# EAGLE design InternetButtonBuzzer (EAGLE 7.2.0)
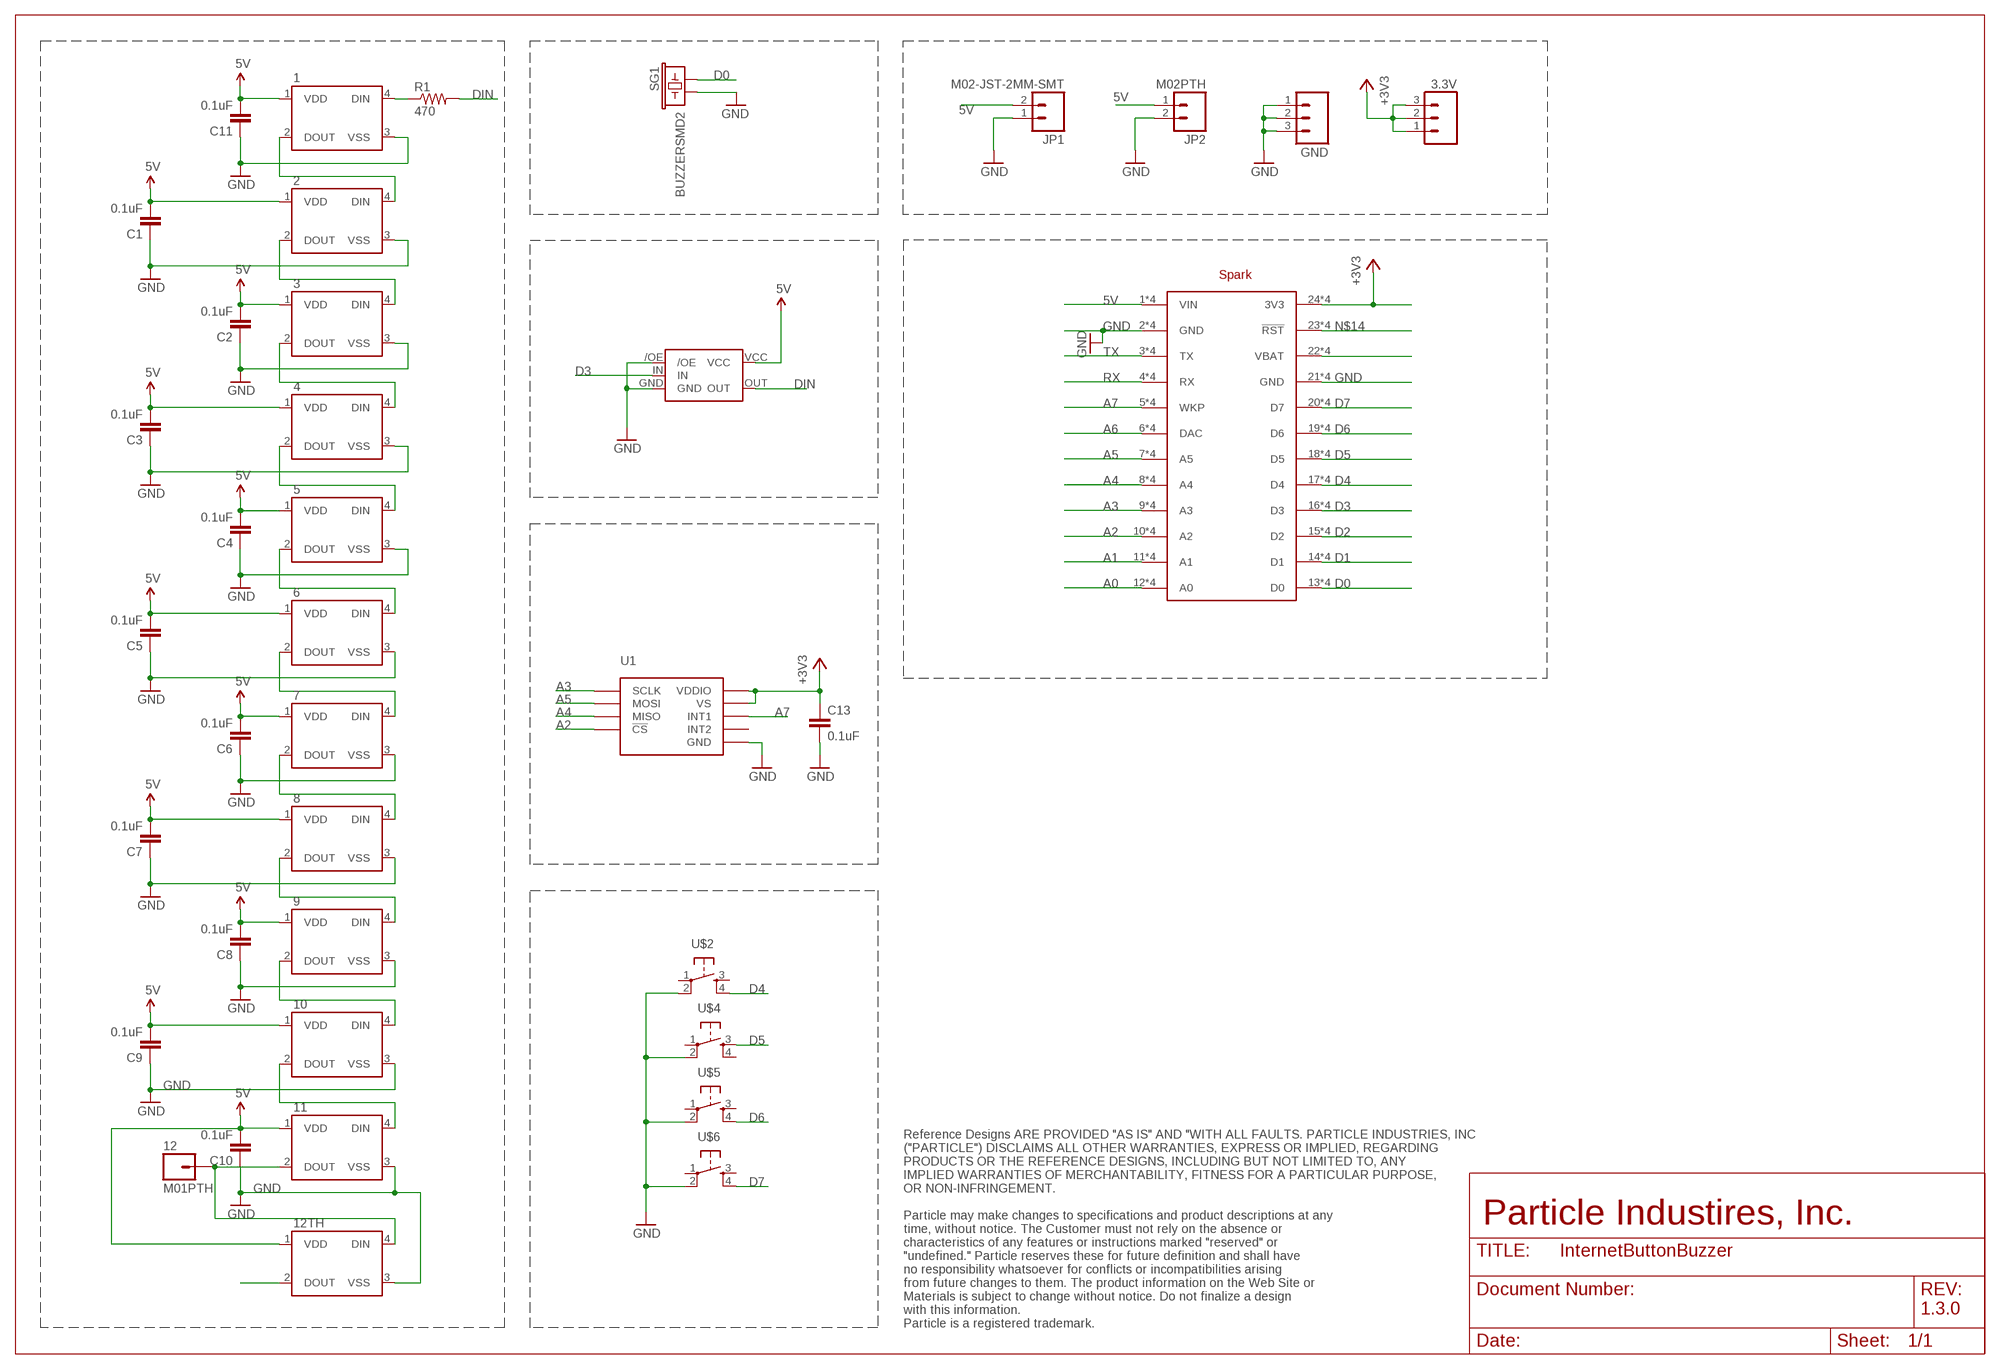
[diagram p0: schematic, sheet 1]

## Parts
1  WS2812B  [WS2812B]
2  WS2812B  [WS2812B]
3  WS2812B  [WS2812B]
3.3V  M03LOCK_NO_SILK  [1X03_LOCK_NO_SILK]
4  WS2812B  [WS2812B]
5  WS2812B  [WS2812B]
6  WS2812B  [WS2812B]
7  WS2812B  [WS2812B]
8  WS2812B  [WS2812B]
9  WS2812B  [WS2812B]
10  WS2812B  [WS2812B]
11  WS2812B  [WS2812B]
12  M01PTH  [1X01]
12TH  WS2812B  [NOCREAM_WS2812B]
C1  0.1uF  15PF-50V-5%(0603)  [0603-CAP]
C2  0.1uF  15PF-50V-5%(0603)  [0603-CAP]
C3  0.1uF  15PF-50V-5%(0603)  [0603-CAP]
C4  0.1uF  15PF-50V-5%(0603)  [0603-CAP]
C5  0.1uF  15PF-50V-5%(0603)  [0603-CAP]
C6  0.1uF  15PF-50V-5%(0603)  [0603-CAP]
C7  0.1uF  15PF-50V-5%(0603)  [0603-CAP]
C8  0.1uF  15PF-50V-5%(0603)  [0603-CAP]
C9  0.1uF  15PF-50V-5%(0603)  [0603-CAP]
C10  0.1uF  15PF-50V-5%(0603)  [0603-CAP]
C11  0.1uF  15PF-50V-5%(0603)  [0603-CAP]
C13  0.1uF  CAP0603-CAP  [0603-CAP]
GND  M03LOCK_NO_SILK  [1X03_LOCK_NO_SILK]
JP1  M02-JST-2MM-SMT  [JST-2-SMD]
JP2  M02PTH  [1X02]
R1  470  470OHM1/10W1%(0603)  [0603-RES]
SG1  BUZZERSMD2  [BUZZER-CCV]
U1  ADXL362ADXL362-1:1  [ADXL362-1:1]
U$2  12MM_TACTILE_SWITCH  [12MM_TACTILE_SWITCH]
U$3  SPARK_LOGO_WITH_PLANE  [SPARK_LOGO_PLUS_PLANE]
U$4  12MM_TACTILE_SWITCH  [12MM_TACTILE_SWITCH]
U$5  12MM_TACTILE_SWITCH  [12MM_TACTILE_SWITCH]
U$6  12MM_TACTILE_SWITCH  [12MM_TACTILE_SWITCH]
U$7  SPARK_COREDUAL_HEADER  [SPARK_CORE_DUAL_HEADER]
U$8  NL17SZ125SOT553  [SOT-553]

## Nets
5V: 1.1(VDD) 2.1(VDD) 3.1(VDD) 4.1(VDD) 5.1(VDD) 6.1(VDD) 7.1(VDD) 8.1(VDD) 9.1(VDD) 10.1(VDD) 11.1(VDD) 12TH.1(VDD) C1.2 C2.2 C3.2 C4.2 C5.2 C6.2 C7.2 C8.2 C9.2 C10.2 C11.2 JP1.2 JP2.1 U$7.1(VIN) U$7.1B(VIN) U$7.@1(VIN) U$7.@1B(VIN) U$8.VCC
+3V3: 3.3V.1 3.3V.2 3.3V.3 C13.1 U1.P$1(VDDIO) U1.P$14(VS) U$7.24(3V3) U$7.24B(3V3) U$7.@24(3V3) U$7.@24B(3V3)
A0: U$7.12(A0) U$7.12B(A0) U$7.@12(A0) U$7.@12B(A0)
A1: U$7.11(A1) U$7.11B(A1) U$7.@11(A1) U$7.@11B(A1)
A2: U1.P$8(!CS) U$7.10(A2) U$7.10B(A2) U$7.@10(A2) U$7.@10B(A2)
A3: U1.P$4(SCLK) U$7.9(A3) U$7.9B(A3) U$7.@9(A3) U$7.@9B(A3)
A4: U1.P$7(MISO) U$7.8(A4) U$7.8B(A4) U$7.@8(A4) U$7.@8B(A4)
A5: U1.P$6(MOSI) U$7.7(A5) U$7.7B(A5) U$7.@7(A5) U$7.@7B(A5)
A6: U$7.6(DAC) U$7.6B(DAC) U$7.@6(DAC) U$7.@6B(DAC)
A7: U1.P$11(INT1) U$7.5(WKP) U$7.5B(WKP) U$7.@5(WKP) U$7.@5B(WKP)
D0: SG1.+ U$7.13(D0) U$7.13B(D0) U$7.@13(D0) U$7.@13B(D0)
D1: U$7.14(D1) U$7.14B(D1) U$7.@14(D1) U$7.@14B(D1)
D2: U$7.15(D2) U$7.15B(D2) U$7.@15(D2) U$7.@15B(D2)
D3: U$7.16(D3) U$7.16B(D3) U$7.@16(D3) U$7.@16B(D3) U$8.IN
D4: U$2.4 U$7.17(D4) U$7.17B(D4) U$7.@17(D4) U$7.@17B(D4)
D5: U$4.3 U$7.18(D5) U$7.18B(D5) U$7.@18(D5) U$7.@18B(D5)
D6: U$5.4 U$7.19(D6) U$7.19B(D6) U$7.@19(D6) U$7.@19B(D6)
D7: U$6.4 U$7.20(D7) U$7.20B(D7) U$7.@20(D7) U$7.@20B(D7)
DIN: R1.2 U$8.OUT
GND: 1.3(VSS) 2.3(VSS) 3.3(VSS) 4.3(VSS) 5.3(VSS) 6.3(VSS) 7.3(VSS) 8.3(VSS) 9.3(VSS) 10.3(VSS) 11.3(VSS) 12TH.3(VSS) C1.1 C2.1 C3.1 C4.1 C5.1 C6.1 C7.1 C8.1 C9.1 C10.1 C11.1 C13.2 GND.1 GND.2 GND.3 JP1.1 JP2.2 SG1.- U1.P$12(GND) U1.P$13(GND) U1.P$16(GND) U$2.2 U$4.2 U$5.2 U$6.2 U$7.2(GND) U$7.2B(GND) U$7.21(GND) U$7.21B(GND) U$7.@2(GND) U$7.@2B(GND) U$7.@21(GND) U$7.@21B(GND) U$8./OE U$8.GND
N$1: 2.2(DOUT) 3.4(DIN)
N$2: 3.2(DOUT) 4.4(DIN)
N$3: 12TH.2(DOUT)
N$5: 11.2(DOUT) 12.1 12TH.4(DIN)
N$8: 7.2(DOUT) 8.4(DIN)
N$9: 8.2(DOUT) 9.4(DIN)
N$11: 9.2(DOUT) 10.4(DIN)
N$12: 10.2(DOUT) 11.4(DIN)
N$14: U$7.23(!RST) U$7.23B(!RST) U$7.@23(!RST) U$7.@23B(!RST)
N$15: U$7.22(VBAT) U$7.22B(VBAT) U$7.@22(VBAT) U$7.@22B(VBAT)
N$16: 1.4(DIN) R1.1
N$17: 4.2(DOUT) 5.4(DIN)
N$18: 5.2(DOUT) 6.4(DIN)
N$19: 6.2(DOUT) 7.4(DIN)
N$24: 1.2(DOUT) 2.4(DIN)
RX: U$7.4(RX) U$7.4B(RX) U$7.@4(RX) U$7.@4B(RX)
TX: U$7.3(TX) U$7.3B(TX) U$7.@3(TX) U$7.@3B(TX)
Unconnected: U1.P$9(INT2) U$2.1 U$2.3 U$4.1 U$4.4 U$5.1 U$5.3 U$6.1 U$6.3

## Notes on the sheet
- Particle Industires, Inc.
- 1.3.0
- Reference Designs ARE PROVIDED "AS IS" AND "WITH ALL FAULTS. PARTICLE INDUSTRIES, INC 
  ("PARTICLE") DISCLAIMS ALL OTHER WARRANTIES, EXPRESS OR IMPLIED, REGARDING 
  PRODUCTS OR THE REFERENCE DESIGNS, INCLUDING BUT NOT LIMITED TO, ANY 
  IMPLIED WARRANTIES OF MERCHANTABILITY, FITNESS FOR A PARTICULAR PURPOSE,
  OR NON-INFRINGEMENT.
  
  Particle may make changes to specifications and product descriptions at any 
  time, without notice. The Customer must not rely on the absence or 
  characteristics of any features or instructions marked "reserved" or 
  "undefined." Particle reserves these for future definition and shall have 
  no responsibility whatsoever for conflicts or incompatibilities arising 
  from future changes to them. The product information on the Web Site or 
  Materials is subject to change without notice. Do not finalize a design 
  with this information. 
  Particle is a registered trademark.

## Library data of the parts
1-11 = SparkFun-LED:WS2812B: WS2812B - Intelligent control LED integrated light source Technical Specifications: Power Supply Voltage (VDD): 3.5 to 5.3 V Input Voltage (VI): -0.5 to VDD+0.5 V Operating Junction Temperature (Topt): -25°C to +80°C Storage Temperature Range (Tstg): -55°C to +150°C
3.3V GND = SparkFun-Connectors:M03: Header 3 Standard 3-pin 0.1" header. Use with straight break away headers (SKU : PRT-00116), right angle break away headers (PRT-00553), swiss pins (PRT-00743), machine pins (PRT-00117), and female headers (PRT-00115). Molex polarized connector foot print use with SKU : PRT-08232 with associated crimp pins and housings.
12 = SparkFun-Connectors:M01: Header 1 Standard 1-pin 0.1" header. Use with straight break away headers (SKU : PRT-00116), right angle break away headers (PRT-00553), swiss pins (PRT-00743), machine pins (PRT-00117), and female headers (PRT-00115).
12TH = Spark:WS2812B: WS2812B - Intelligent control LED integrated light source Technical Specifications: Power Supply Voltage (VDD): 3.5 to 5.3 V Input Voltage (VI): -0.5 to VDD+0.5 V Operating Junction Temperature (Topt): -25°C to +80°C Storage Temperature Range (Tstg): -55°C to +150°C
C1-C11 = SparkFun-Capacitors:15PF-50V-5%(0603): CAP-07881; PROD_ID: CAP-07881; VALUE: 15pF
C13 = SparkFun-Passives:CAP: Capacitor Standard 0603 ceramic capacitor, and 0.1" leaded capacitor.
JP1 = SparkFun-Connectors:M02: Standard 2-pin 0.1" header. Use with - straight break away headers ( PRT-00116) - right angle break away headers (PRT-00553) - swiss pins (PRT-00743) - machine pins (PRT-00117) - female headers (PRT-00115) Molex polarized connector foot print use with: PRT-08233 with associated crimp pins and housings. 2.54_SCREWTERM for use with PRT-10571. 3.5mm Screw Terminal footprints for PRT-08084 5mm Screw Terminal footprints for use with PRT-08432; PROD_ID: CONN-08352
JP2 = SparkFun-Connectors:M02: Standard 2-pin 0.1" header. Use with - straight break away headers ( PRT-00116) - right angle break away headers (PRT-00553) - swiss pins (PRT-00743) - machine pins (PRT-00117) - female headers (PRT-00115) Molex polarized connector foot print use with: PRT-08233 with associated crimp pins and housings. 2.54_SCREWTERM for use with PRT-10571. 3.5mm Screw Terminal footprints for PRT-08084 5mm Screw Terminal footprints for use with PRT-08432
R1 = SparkFun-Resistors:470OHM1/10W1%(0603): RES-07869; PROD_ID: RES-07869
SG1 = SparkFun-Electromechanical:BUZZER: Buzzer 12mm Spark Fun Electronics SKU : Comp-Buzzer
U1 = SparkFun-Sensors:ADXL362: Micropower 3-axis accelerometer 2/4/8g digital output (SPI) IC-11297
U$2 U$4-U$6 = Spark:12MM_TACTILE_SWITCH: 12MM tactile switch based on TL3300AF260Q http://www.digikey.com/product-detail/en/TL3300AF260Q/EG4903CT-ND/2498461
U$3 = Spark:SPARK_LOGO_WITH_PLANE
U$7 = Spark:SPARK_CORE
U$8 = Spark:NL17SZ125

## Board
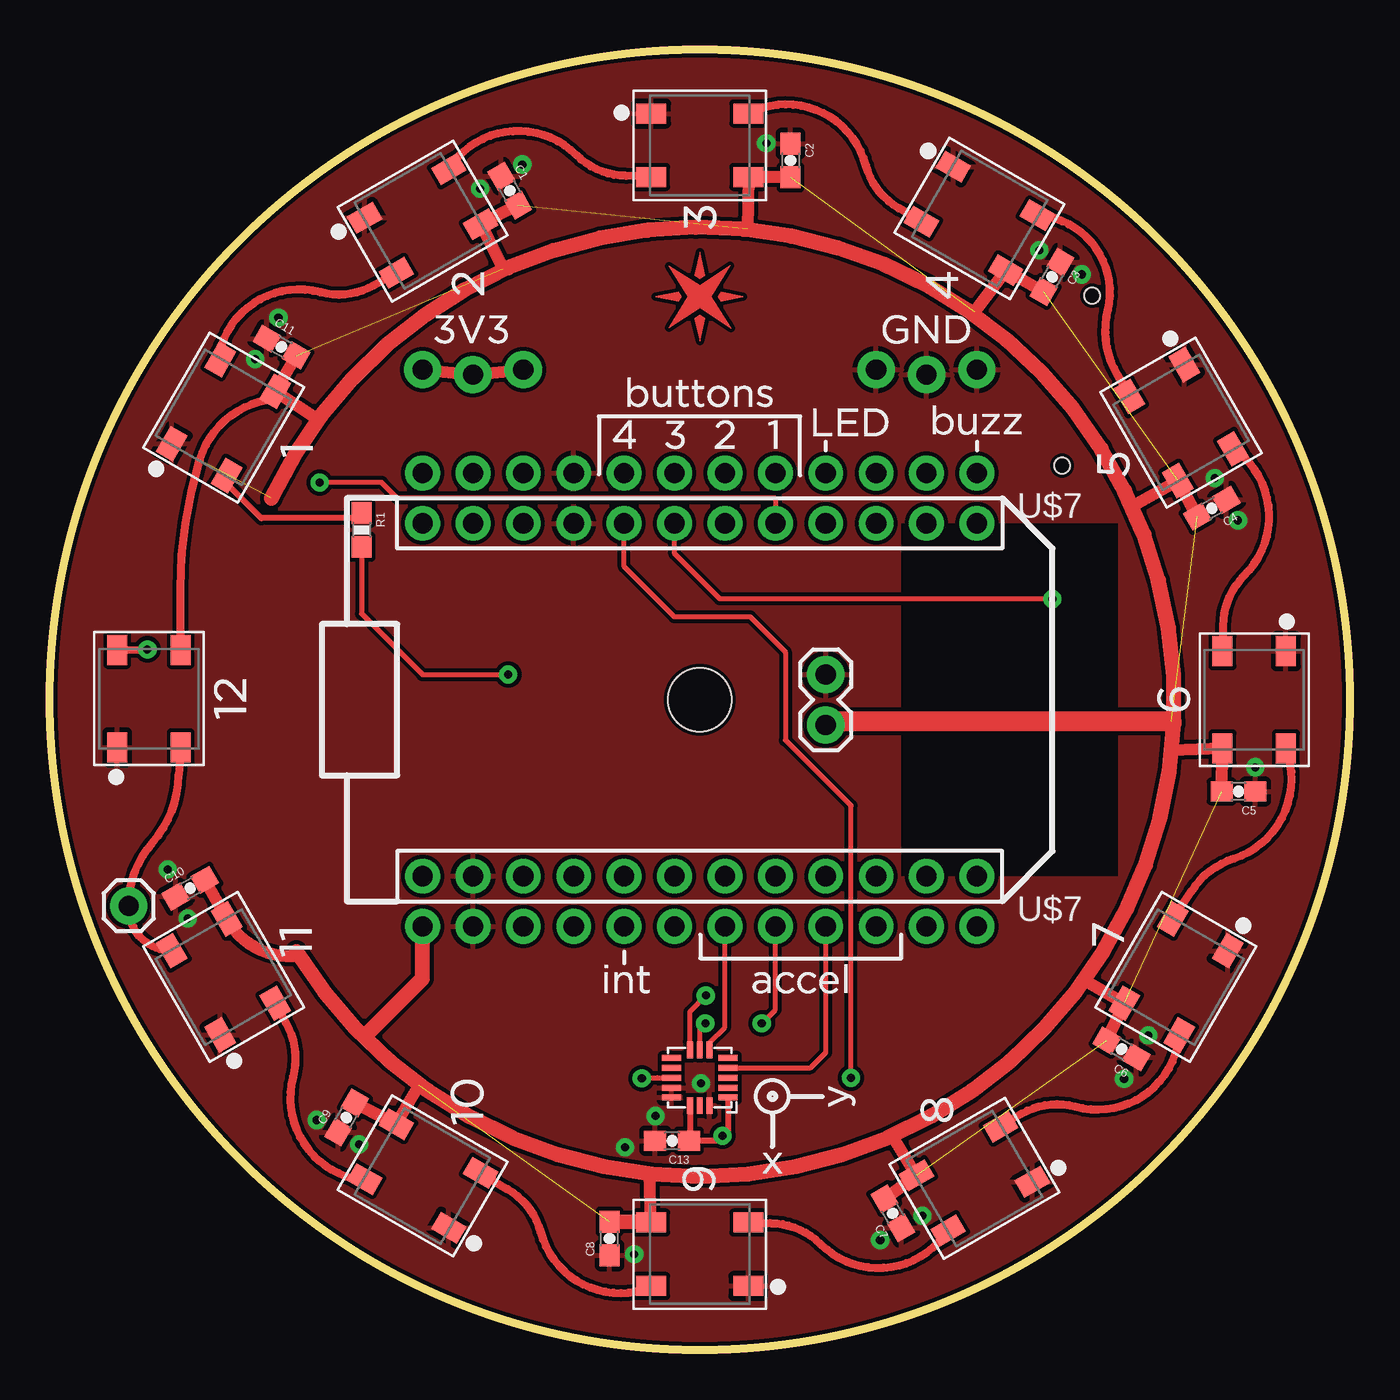
[diagram p1: board, top side]
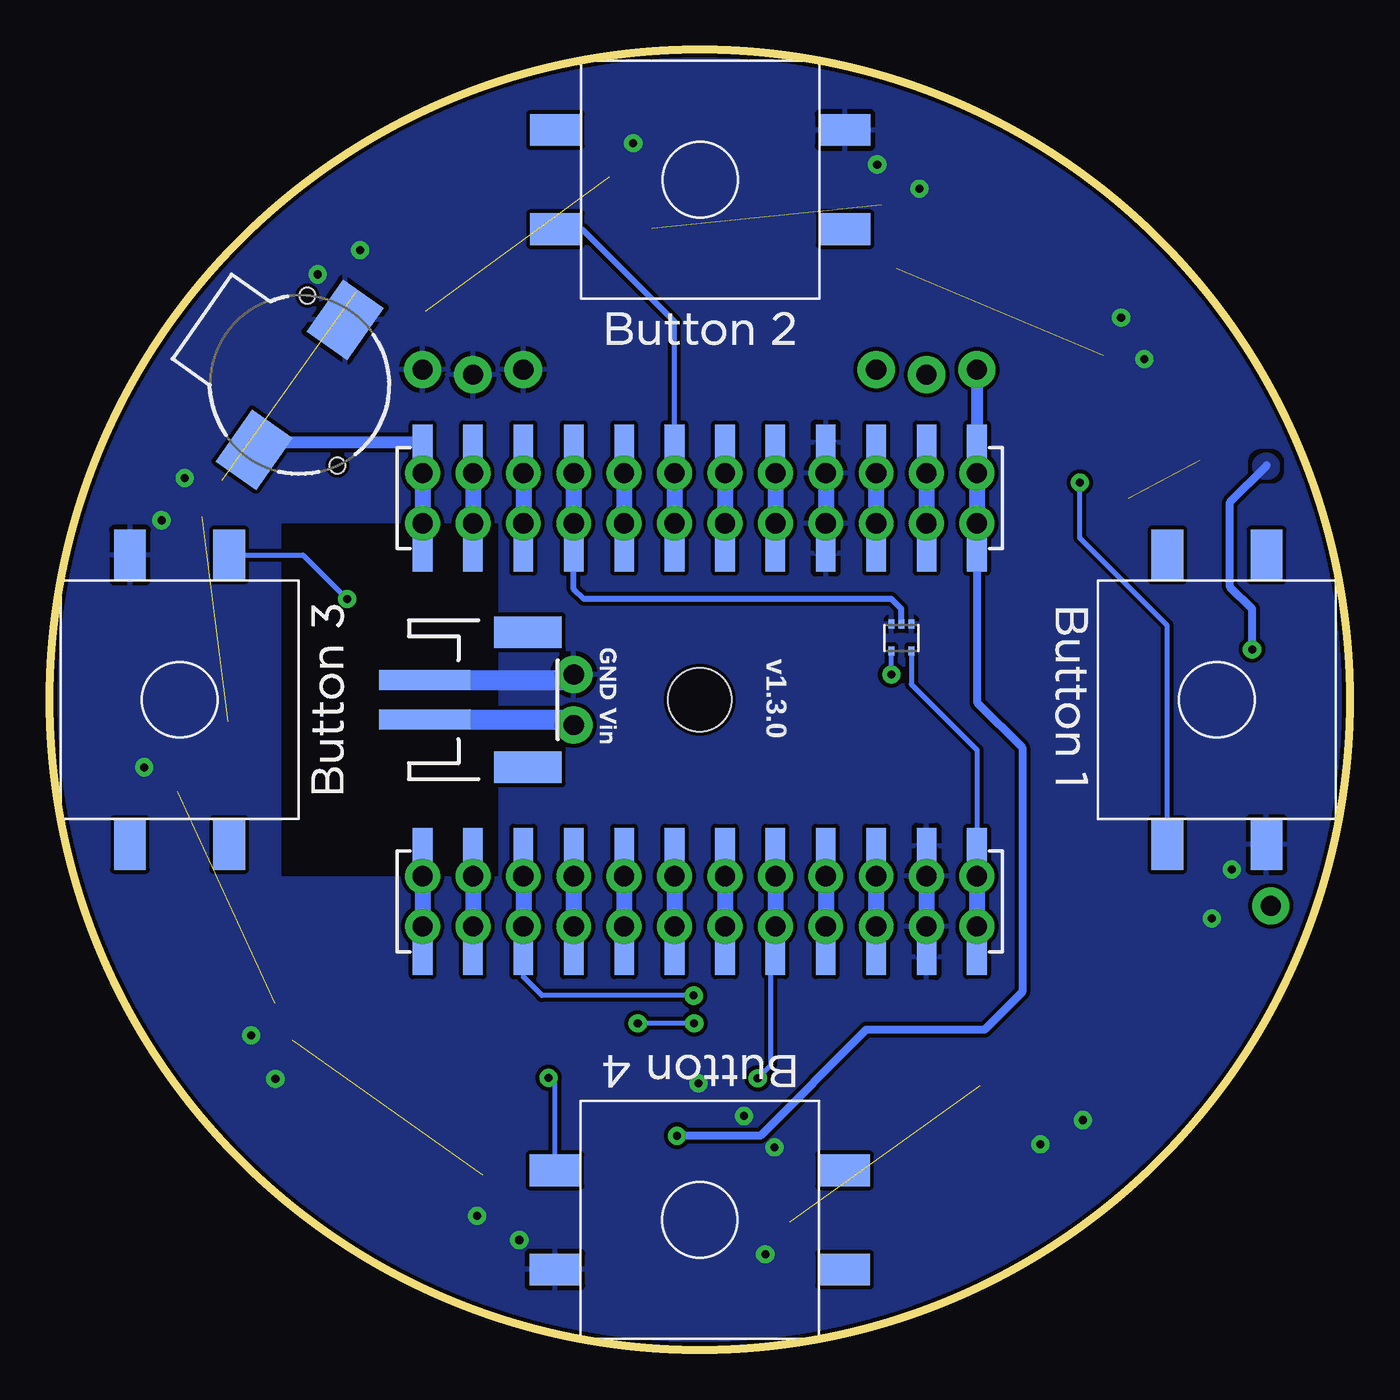
[diagram p2: board, bottom side, seen from below]

Size 65.53 x 65.53 mm. Coordinates in mm from the lower left corner, seen from the top.
Outline: circle at 32.77,32.77 radius 32.77
Copper layers (1*16): Top 0.035mm / dielectric 1.5mm / Bottom 0.035mm
Design rules "SparkFun-2-layer": minimum track width 7mil, minimum drill 15mil, track to track 8mil, track to pad 8mil, pad to pad 8mil, via to via 8mil, smd to smd 8mil, copper to edge 8mil, drill to drill 8mil, minimum pad ring 12mil, minimum via ring 10mil, stop-mask expansion 4mil, vias tented up to drill 20mil, thermal gap 10mil
Holes 3.17 mm at 32.77,32.77
tRestrict: area 42.9,23.9 to 53.8,41.7
bRestrict: area 42.9,23.9 to 53.8,41.7

### Footprints (pad centres in the part's own frame; a part is rotated, then mirrored left to right if it is on the bottom)
WS2812B = smd 1.5 x 1: 1 -2.45,1.6; 2 -2.45,-1.6; 3 2.45,-1.6; 4 2.45,1.6
1X03_LOCK_NO_SILK = drill 1.016 pad 1.88: 1 0,0.127; 2 2.54,-0.127; 3 5.08,0.127
1X01 = drill 1.016 pad 1.88: 1 0,0
NOCREAM_WS2812B = smd 1.5 x 1: 1 -2.45,1.6; 2 -2.45,-1.6; 3 2.45,-1.6; 4 2.45,1.6
0603-CAP = smd 1.1 x 1: 1 -0.85,0; 2 0.85,0
JST-2-SMD = smd 1 x 4.6: 1 -1,-3.7; 2 1,-3.7 | smd 1.6 x 3.4: NC1 -3.4,1.5; NC2 3.4,1.5
1X02 = drill 1.016 pad 1.88: 1 0,0; 2 2.54,0
0603-RES = smd 1.1 x 1: 1 -0.85,0; 2 0.85,0
BUZZER-CCV = smd 3.2 x 2.5: + 4,0; - -4,0 | hole 0.8: -3.9,-2.25; 2.25,3.9
ADXL362-1:1 = smd 0.952 x 0.3: P$1 -1.426,1; P$2 -1.426,0.5; P$3 -1.426,0; P$4 -1.426,-0.5; P$5 -1.426,-1; P$9 1.426,-1; P$10 1.426,-0.5; P$11 1.426,0; P$12 1.426,0.5; P$13 1.426,1 | smd 0.3 x 0.851: P$6 -0.5,-1.402; P$7 0,-1.402; P$8 0.5,-1.402; P$14 0.5,1.402; P$15 0,1.402; P$16 -0.5,1.402
12MM_TACTILE_SWITCH = smd 2.54 x 1.6: 1 -7.3,2.5; 2 7.3,2.5; 3 -7.3,-2.5; 4 7.3,-2.5
SPARK_CORE_DUAL_HEADER = drill 1.016 pad 1.753: 1 -8.89,13.97; 2 -8.89,11.43; 3 -8.89,8.89; 4 -8.89,6.35; 5 -8.89,3.81; 6 -8.89,1.27; 7 -8.89,-1.27; 8 -8.89,-3.81; 9 -8.89,-6.35; 10 -8.89,-8.89; 11 -8.89,-11.43; 12 -8.89,-13.97; 13 8.89,-13.97; 14 8.89,-11.43; 15 8.89,-8.89; 16 8.89,-6.35; 17 8.89,-3.81; 18 8.89,-1.27; 19 8.89,1.27; 20 8.89,3.81; 21 8.89,6.35; 22 8.89,8.89; 23 8.89,11.43; 24 8.89,13.97; @1 -11.43,13.97; @2 -11.43,11.43; @3 -11.43,8.89; @4 -11.43,6.35; @5 -11.43,3.81; @6 -11.43,1.27; @7 -11.43,-1.27; @8 -11.43,-3.81; @9 -11.43,-6.35; @10 -11.43,-8.89; @11 -11.43,-11.43; @12 -11.43,-13.97; @13 11.43,-13.97; @14 11.43,-11.43; @15 11.43,-8.89; @16 11.43,-6.35; @17 11.43,-3.81; @18 11.43,-1.27; @19 11.43,1.27; @20 11.43,3.81; @21 11.43,6.35; @22 11.43,8.89; @23 11.43,11.43; @24 11.43,13.97 | smd 1.829 x 0.991 bottom: 1B -7.366,13.97; 2B -7.366,11.43; 3B -7.366,8.89; 4B -7.366,6.35; 5B -7.366,3.81; 6B -7.366,1.27; 7B -7.366,-1.27; 8B -7.366,-3.81; 9B -7.366,-6.35; 10B -7.366,-8.89; 11B -7.366,-11.43; 12B -7.366,-13.97; 13B 7.366,-13.97; 14B 7.366,-11.43; 15B 7.366,-8.89; 16B 7.366,-6.35; 17B 7.366,-3.81; 18B 7.366,-1.27; 19B 7.366,1.27; 20B 7.366,3.81; 21B 7.366,6.35; 22B 7.366,8.89; 23B 7.366,11.43; 24B 7.366,13.97; @1B -12.954,13.97; @2B -12.954,11.43; @3B -12.954,8.89; @4B -12.954,6.35; @5B -12.954,3.81; @6B -12.954,1.27; @7B -12.954,-1.27; @8B -12.954,-3.81; @9B -12.954,-6.35; @10B -12.954,-8.89; @11B -12.954,-11.43; @12B -12.954,-13.97; @13B 12.954,-13.97; @14B 12.954,-11.43; @15B 12.954,-8.89; @16B 12.954,-6.35; @17B 12.954,-3.81; @18B 12.954,-1.27; @19B 12.954,1.27; @20B 12.954,3.81; @21B 12.954,6.35; @22B 12.954,8.89; @23B 12.954,11.43; @24B 12.954,13.97
SOT-553 = smd 0.3 x 0.45: /OE -0.5,0; GND 0.5,0; IN 0,0; OUT 0.5,1.35; VCC -0.5,1.35

### Placement (x,y rotation side)
1  8.76,46.99 240 top
2  18.8,56.9 210 top
3  32.77,60.71 180 top
3.3V  18.8,49.28 0 top
4  46.86,57.02 150 top
5  57.02,46.74 120 top
6  60.71,32.77 90 top
7  56.77,18.8 60 top
8  46.61,8.64 30 top
9  32.77,4.83 0 top
10  18.8,8.76 330 top
11  8.76,18.8 300 top
12  3.99,22.38 0 top
12TH  5,32.82 270 top
C1  23.19,58.42 300 top
C2  37.34,59.94 270 top
C3  50.52,54.08 240 top
C4  58.57,42.42 210 top
C5  59.92,28.14 180 top
C6  54.03,15.16 150 top
C7  42.49,6.88 120 top
C8  28.22,5.61 90 top
C9  14.96,11.71 60 top
C10  7.09,23.27 30 top
C11  11.68,50.55 330 top
C13  31.37,10.54 180 top
GND  41.66,49.28 0 top
JP1  42.93,32.77 270 bottom
JP2  39.12,31.5 90 top
R1  15.72,41.33 270 top
SG1  52.93,48.64 235 bottom
U1  32.77,13.72 180 top
U$2  6.71,32.77 270 bottom
U$3  32.77,53.09 0 top
U$4  32.74,58.98 0 bottom
U$5  58.98,32.77 90 bottom
U$6  32.77,6.55 180 bottom
U$7  32.77,32.77 90 top
U$8  22.61,36.58 180 bottom

### Tracks (layer width: path | path; a pad name or v marks a point on that pad's centre or on a via)
5V  (9 unrouted)
  Top 0.254: 12.45,20.07 12.59,19.88 15.9,15.82 18.62,13.33 | 56.54,30.23 56.54,30.2 56.53,31.67 | 6.1 59.44,30.23
  Top 0.406: 1.1 10.94,47.88 arc62 7.57,44.86 arc17 6.6,38.4 12TH.1
  Top 0.61: C6.2 7.1 52.07,18.67 | C5.2 6.1 56.54,30.2 | C4.2 5.1 54.61,42.54 | C3.2 4.1 46.61,52.32 | C2.2 3.1 35.18,56.51 | C1.2 2.1 22.86,54.48 | C11.2 1.1 13.59,46.86 | 9.1 30.23,8.89 | C7.2 8.1 42.55,10.67 | C9.2 10.1 18.62,13.33 | C10.2 11.1 arc69 12.59,19.88
  Top 0.762: 15.9,15.82 18.8,18.72 U$7.@1 | 12.45,20.07 arc303 11.18,42.93 | 9.1 C8.2
  Top 1.016: 56.53,31.67 39.29,31.67 JP2.1
  Bottom 0.254: U$8.VCC 22.11,33.54 18.8,30.23 18.8,25.91 U$7.1B
  Bottom 0.406: U$7.@1B U$7.@1 U$7.1 18.8,25.91
  Bottom 1.016: JP1.2 39.39,31.77 JP2.1
+3V3  (via drill 0.41)
  Top 0.305: U1.P$14 32.27,10.54 C13.1 33.66,10.54 v33.91,10.79 34.19,11.08 U1.P$1
  Top 0.61: 3.3V.1 3.3V.2 3.3V.3
  Bottom 0.406: v33.91,10.79 29.72,10.79 24.38,16.13 18.41,16.13 16.51,18.03 16.51,30.35 18.8,32.64 U$7.24B | U$7.24 U$7.24B | U$7.24B U$7.@24
  Bottom 0.61: 3.3V.1 U$7.@24B 18.8,45.21 U$7.@24
A0
  Bottom 0.406: U$7.12B 46.61,25.4 46.61,23.24 46.74,23.24 U$7.12 U$7.@12 U$7.@12B
A1
  Bottom 0.406: U$7.@11B U$7.@11 U$7.11 U$7.11B
A2  (via drill 0.41 pad 0.51)
  Top 0.254: U1.P$8 32.27,17.03 v33.07,17.86
  Bottom 0.254: v33.07,17.86 40.72,17.86 41.66,18.8 U$7.@10B
  Bottom 0.406: U$7.10B U$7.10 U$7.@10 U$7.@10B
A3
  Top 0.254: U1.P$4 38.35,14.22 39.12,14.99 U$7.@9
  Bottom 0.406: U$7.@9B U$7.@9 U$7.9 U$7.9B
A4  (via drill 0.41, 0.41 pad 0.61)
  Top 0.254: U1.P$7 32.77,16.18 v33.05,16.46 | v35.89,16.46 36.58,17.14 U$7.@8
  Bottom 0.254: v33.05,16.46 v35.89,16.46
  Bottom 0.406: U$7.8B U$7.8 U$7.@8 U$7.@8B
A5
  Top 0.254: U1.P$6 33.27,15.49 34.04,16.26 U$7.@7
  Bottom 0.406: U$7.@7B U$7.@7 U$7.7 U$7.7B
A6
  Bottom 0.406: U$7.6B U$7.6 U$7.@6 U$7.@6B
A7  (via drill 0.41)
  Top 0.254: 30.63,13.72 U1.P$11 29.87,13.72 v29.84,13.69
  Bottom 0.254: U$7.@5B 29.21,19.81 29.21,14.33 v29.84,13.69
  Bottom 0.406: U$7.@5B U$7.@5 U$7.5 U$7.5B
D0
  Bottom 0.406: U$7.13B U$7.13 U$7.@13 U$7.@13B
  Bottom 0.61: U$7.@13B 54.87,45.72 SG1.+
D1
  Bottom 0.406: U$7.@14B U$7.@14 U$7.14 U$7.14B
D2
  Bottom 0.406: U$7.15B U$7.15 U$7.@15 U$7.@15B
D3
  Bottom 0.254: U$7.16B 39.12,40.64
  Bottom 0.305: U$8.IN 22.61,37.34 23.11,37.85 38.61,37.85 39.12,38.35 39.12,40.64 39.12,41.15
  Bottom 0.406: U$7.@16B U$7.@16 U$7.16 39.12,40.64
D4  (via drill 0.41)
  Top 0.254: v13.61,43.71 16.74,43.71 17.53,42.93 36.58,42.93 U$7.17
  Bottom 0.254: U$2.4 9.21,36.51 13.61,40.92 v13.61,43.71
  Bottom 0.61: U$7.17B U$7.17 U$7.@17 U$7.@17B
D5
  Bottom 0.254: U$7.@18B 34.04,51.82
  Bottom 0.305: 34.04,51.82 38.7,56.48 U$4.3
  Bottom 0.61: U$7.@18B U$7.@18 | 34.04,43.56 U$7.@18 | U$7.@18 U$7.18 U$7.18B
D6  (via drill 0.41)
  Top 0.254: v50.55,37.85 33.78,37.85 U$7.19B U$7.19
  Bottom 0.254: U$5.4 52.77,40.07 v50.55,37.85 | U$7.19 U$7.19B
  Bottom 0.61: U$7.19 U$7.@19 U$7.@19B
D7  (via drill 0.41)
  Top 0.254: v40.39,13.72 40.39,27.43 37.08,30.73 37.08,35.18 35.31,36.96 31.47,36.96 28.96,39.47 U$7.20
  Bottom 0.254: U$6.4 40.07,13.4 v40.39,13.72
  Bottom 0.61: U$7.@20B U$7.@20 U$7.20 U$7.20B
DIN  (via drill 0.41)
  Top 0.254: R1.2 15.72,37.11 18.8,34.04 v23.11,34.04
  Bottom 0.254: v23.11,34.04 23.11,34.81 U$8.OUT
GND  (via drill 0.41)
  Bottom 1.016: JP1.1 39.39,33.77 JP2.2
  other vias: 15.6,10.36 13.46,11.58 6.96,21.74 5.94,24.21 11.53,52.02 10.36,49.94 23.83,59.74 21.69,58.52 36.12,60.81 52.02,54.2 49.89,55.42 59.89,41.81 58.72,43.94 60.76,29.36 54.15,13.67 55.37,15.85 41.86,5.54 43.99,6.76 29.46,4.83 32.84,13.43 30.53,11.79 29.01,10.21
  pour Top (rank 2): -1.52,-0.25 -1.52,65.79 67.06,65.79 67.06,-0.25
  pour Bottom (rank 2): -1.52,-0.25 -1.52,65.79 67.06,65.79 67.06,-0.25
N$1
  Top 0.406: 2.2 2.2 arc-102 26.55,60.21 arc45 29.06,59.17 30.38,59.16 30.32,59.16 3.4
N$2
  Top 0.406: 4.4 42.8,57.53 arc-45 41.15,59.69 arc102 3.2
N$3  (via drill 0.41)
  Top 0.406: 12TH.2 v4.93,35.31
  Bottom 0.406: v4.93,35.31 4.93,37.34 6.04,38.46 6.04,42.72 4.19,44.58
  pour Bottom (no thermals): 4.19,43.97 arc-90 3.63,44.53 arc-90 4.19,45.08 4.29,45.08 arc-90 4.8,44.53 arc-90
N$5
  Top 0.406: 11.2 arc-90 3.99,22.28 12.1 arc-41 5.18,25.55 arc40 6.5,28.96 12TH.4
N$8
  Top 0.406: 8.4 47.84,11.25 47.84,11.26 48.99,11.91 arc-45 51.69,12.26 arc102 56.97,16.04 7.2
N$9
  Top 0.406: 8.2 45.29,6.04 45.28,6.04 arc-102 38.84,5.34 arc45 36.33,6.39 35.01,6.4 35.22,6.4 9.4
N$11
  Top 0.406: 10.4 21.95,8.92 21.95,8.77 23.09,8.1 arc-45 24.74,5.94 arc102 30.67,3.33 30.32,3.33 9.2
N$12
  Top 0.406: 10.2 16.09,8.6 16.09,8.54 arc-102 12.27,13.77 arc45 11.91,16.46 11.26,17.61 11.37,17.61 11.4
N$14
  Bottom 0.61: U$7.23B U$7.23 U$7.@23 U$7.@23B
N$15
  Bottom 0.61: U$7.@22B U$7.@22 U$7.22 U$7.22B
N$16
  Top 0.254: 9.05,44.2 1.4 | R1.1 15.71,42.19
  Top 0.305: 15.71,42.19 15.43,41.91 10.67,41.91 8.92,43.65 1.4
N$17
  Top 0.406: 4.2 49.61,57.18 49.61,57.18 arc-102 53.34,52.41 arc45 53.82,49.15 54.45,48.18 54.41,48.18 5.4
N$18
  Top 0.406: 5.2 59.63,45.46 59.62,45.46 arc-102 60.2,39.01 arc45 59.15,36.5 59.14,35.18 59.11,35.18 6.4
N$19
  Top 0.406: 7.4 57.53,23.11 arc-38 59.69,24.76 arc93 6.2
N$24
  Top 0.406: 8.47,49.54 8.6,49.54 1.2 8.6,49.47 8.44,49.47 8.43,49.47 8.42,49.47 arc-102 13.66,53.3 arc45 16.35,53.65 17.37,54.18 17.47,54.18 2.4 17.42,54.28 17.42,54.24
RX
  Bottom 0.406: U$7.4B U$7.4 U$7.@4 U$7.@4B
TX
  Bottom 0.406: U$7.@3B U$7.@3 U$7.3 U$7.3B

### Text on the board
bPlace: v1.3.0
tDocu: Reference Designs ARE PROVIDED "AS IS" AND "WITH ALL FAULTS. PARTICLE INDUSTRIES, INC / ("PARTICLE") DISCLAIMS ALL OTHER WARRANTIES, EXPRESS OR IMPLIED, REGARDING / PRODUCTS OR THE REFERENCE DESIGNS, INCLUDING BUT NOT LIMITED TO, ANY / IMPLIED WARRANTIES OF MERCHANTABILITY, FITNESS FOR A PARTICULAR PURPOSE, / OR NON-INFRINGEMENT. / / Particle may make changes to specifications and product descriptions at any / time, without notice. The Customer must not rely on the absence or / characteristics of any features or instructions marked "reserved" or / "undefined." Particle reserves these for future definition and shall have / no responsibility whatsoever for conflicts or incompatibilities arising / from future changes to them. The product information on the Web Site or / Materials is subject to change without notice. Do not finalize a design / with this information. / Particle is a registered trademark.